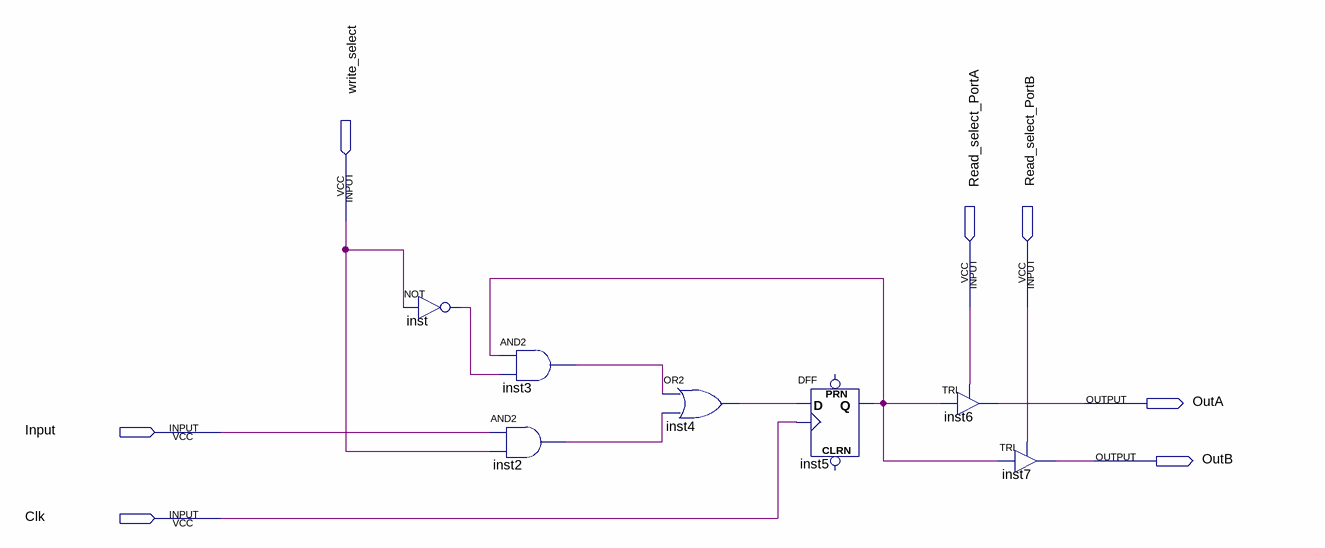
[diagram p0: schematic sheet]
// Quartus schematic register_file_cell.bdf as structural Verilog: 7 symbols, 7 pins
module register_file_cell (
  input  write_select,
  input  Read_select_PortA,
  input  Read_select_PortB,
  input  Input,
  input  Clk,
  output OutA,
  output OutB
);

  wire inst2_out, inst3_out, inst4_out, inst5_q, inst_out;

  not inst (inst_out, write_select);
  and inst3 (inst3_out, inst5_q, inst_out);
  and inst2 (inst2_out, Input, write_select);
  or inst4 (inst4_out, inst3_out, inst2_out);
  DFF inst5 (.CLK(Clk), .D(inst4_out), .Q(inst5_q));  // open: CLRN, PRN
  TRI inst6 (.IN(inst5_q), .OE(Read_select_PortA), .OUT(OutA));
  TRI inst7 (.IN(inst5_q), .OE(Read_select_PortB), .OUT(OutB));
endmodule
